# Altium schematic sheet Motor_Driver_2021.SchDoc
size A4; SheetNumber: 1; SheetTotal: 2
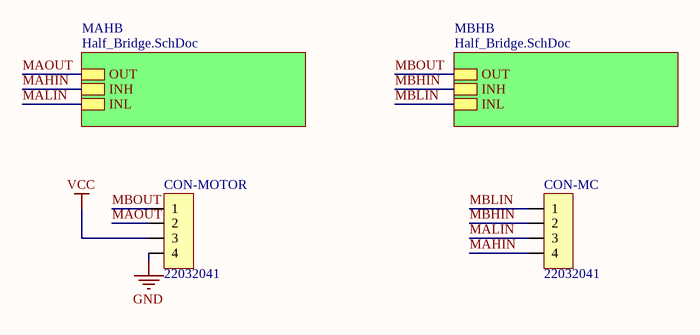
[diagram p0: Motor_Driver_2021.SchDoc]

## Parts
CON-MC  22032041  [04x01_Conector_Male]
CON-MOTOR  22032041  [04x01_Conector_Male]

## Sub-sheets
MAHB = Half_Bridge.SchDoc: OUT, INH, INL
MBHB = Half_Bridge.SchDoc: OUT, INH, INL

## Nets
GND: CON-MOTOR.4
VCC: CON-MOTOR.3
MAHIN: CON-MC.4 ; sheet MAHB/INH
MALIN: CON-MC.3 ; sheet MAHB/INL
MAOUT: CON-MOTOR.2 ; sheet MAHB/OUT
MBHIN: CON-MC.2 ; sheet MBHB/INH
MBLIN: CON-MC.1 ; sheet MBHB/INL
MBOUT: CON-MOTOR.1 ; sheet MBHB/OUT

## Library data of the parts
CON-MC CON-MOTOR = 04x01_Conector_Male-SCH: CONN HEADER 4POS .100 VERT TIN